# Altium schematic sheet IOs.SchDoc
size A3; SheetNumber: 8; SheetTotal: 11
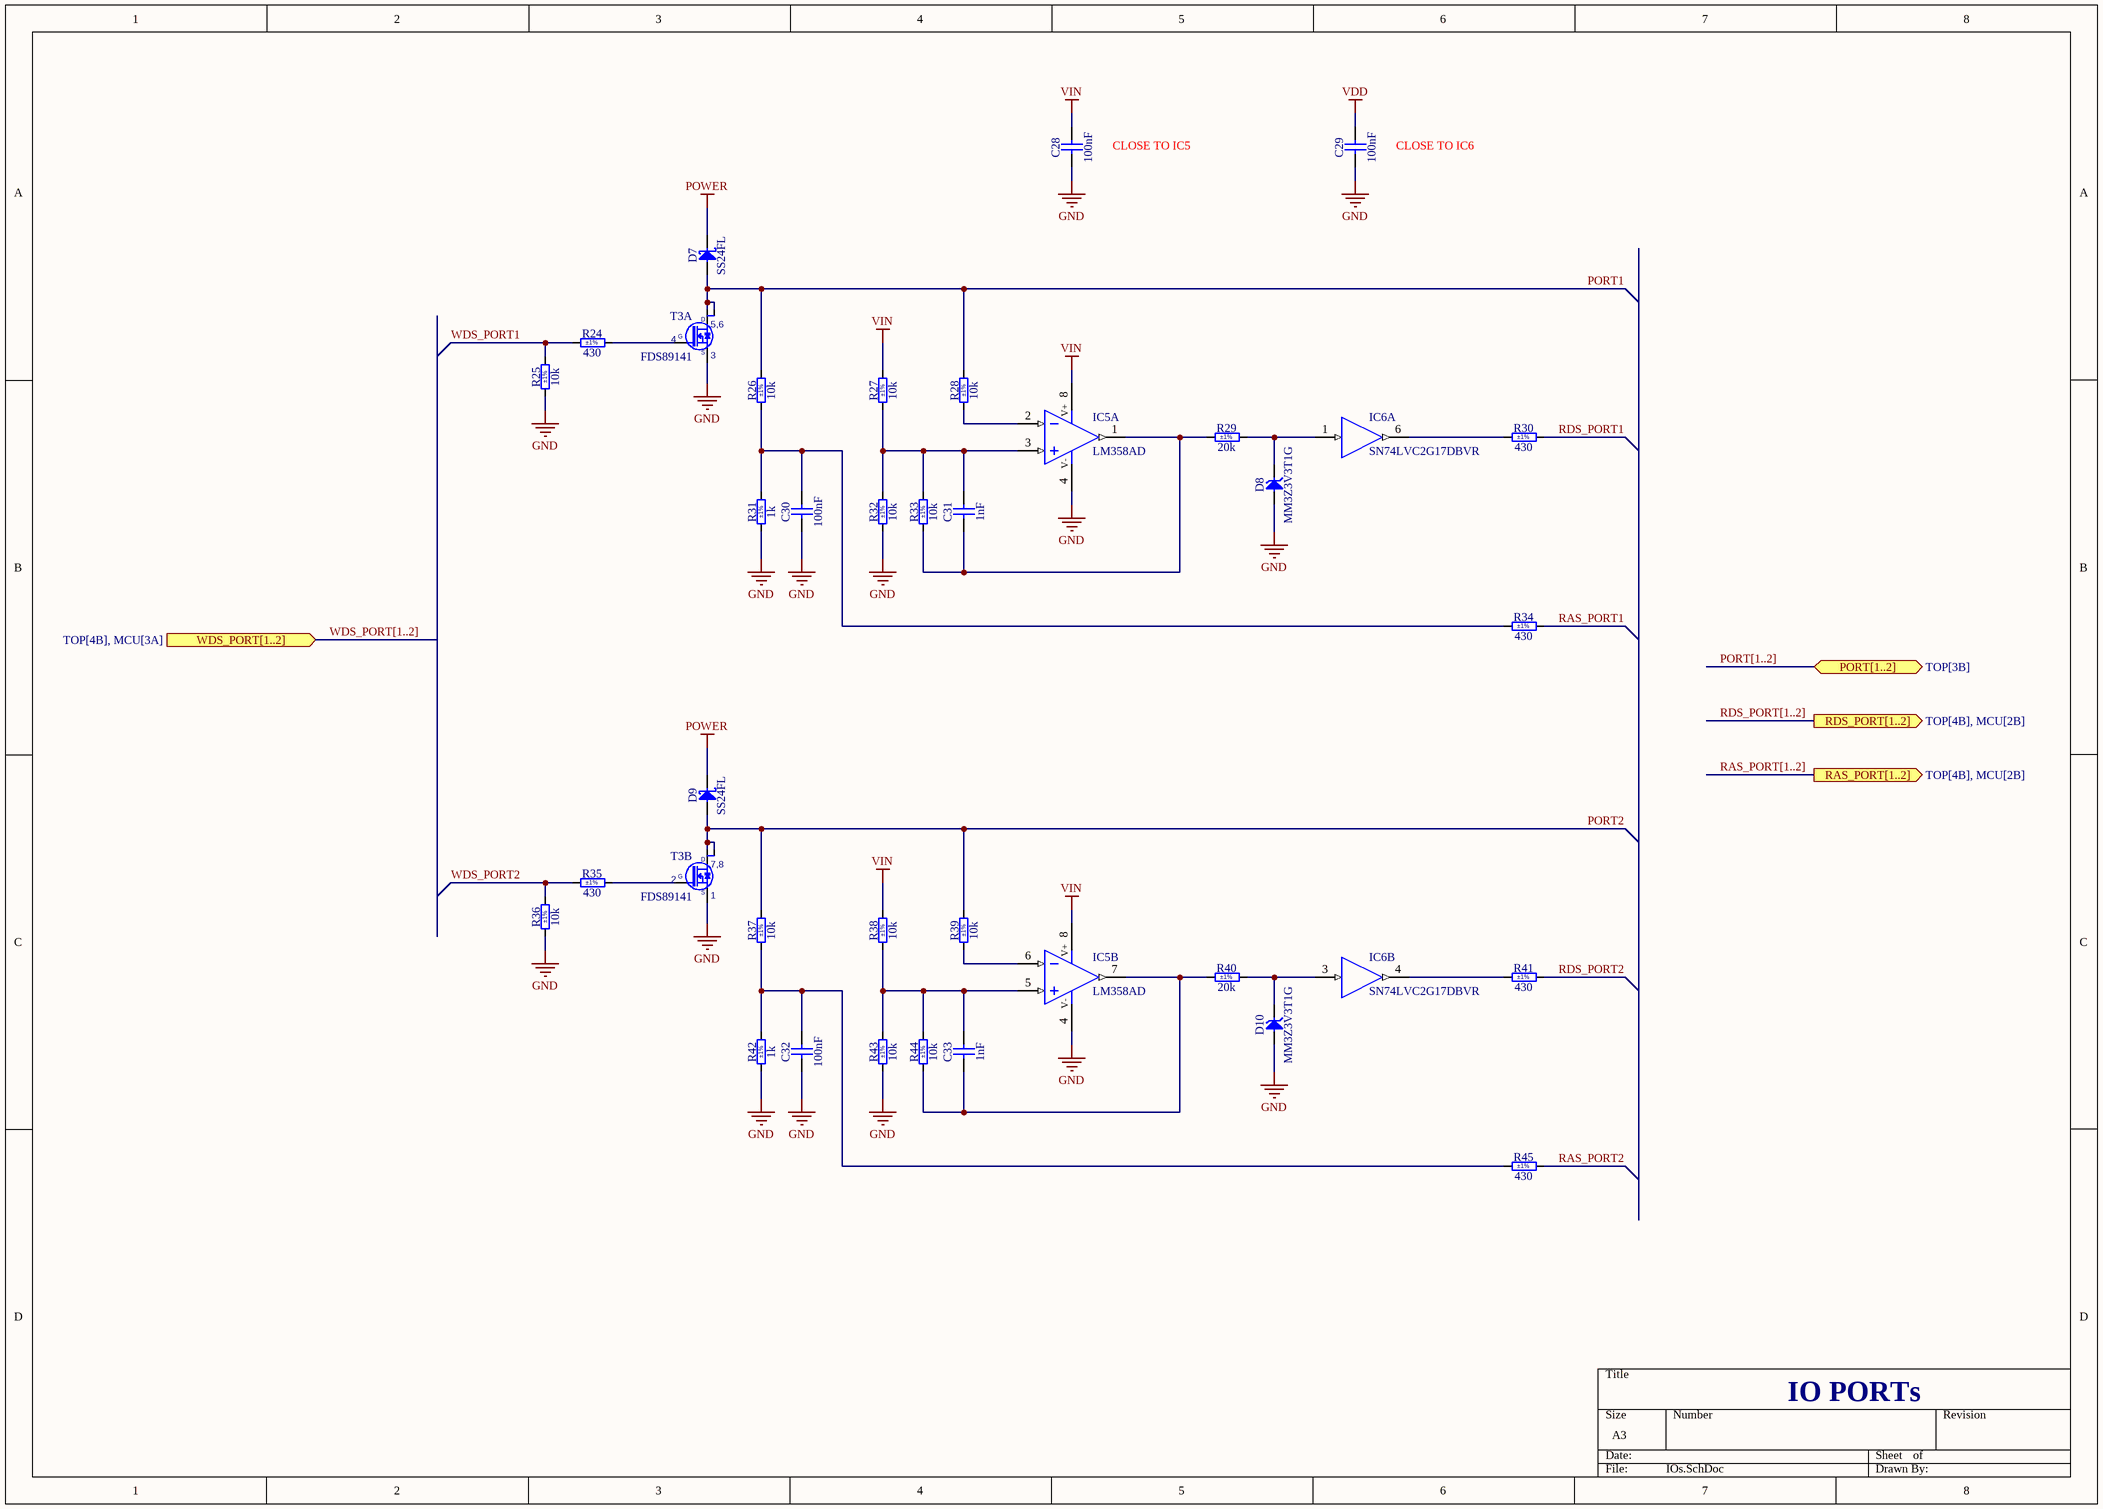
[diagram p0: IOs.SchDoc]

## Parts
C28  100nF  [CAPC1608X90N]
C29  100nF  [CAPC1608X87N]
C30  100nF  [CAPC1608X87N]
C31  1nF  [CAPC1608X87N]
C32  100nF  [CAPC1608X87N]
C33  1nF  [CAPC1608X87N]
D7  SS24FL  [SODFL3617X108N]
D8  MM3Z3V3T1G  [SOD2512X110N]
D9  SS24FL  [SODFL3617X108N]
D10  MM3Z3V3T1G  [SOD2512X110N]
IC5  LM358AD  [SOIC127P600X175-8N]  (parts A,B of 2)
IC6  SN74LVC2G17DBVR  [SOT95P280X145-6N]  (parts A,B of 2)
R24  430  Tolerance: ±1%  [RESC1608X55N]
R25  10k  Tolerance: ±1%  [RESC1608X55N]
R26  10k  Tolerance: ±1%  [RESC3216X65N]
R27  10k  Tolerance: ±1%  [RESC1608X55N]
R28  10k  Tolerance: ±1%  [RESC1608X55N]
R29  20k  Tolerance: ±1%  [RESC1608X55N]
R30  430  Tolerance: ±1%  [RESC1608X55N]
R31  1k  Tolerance: ±1%  [RESC1608X55N]
R32  10k  Tolerance: ±1%  [RESC1608X55N]
R33  10k  Tolerance: ±1%  [RESC1608X55N]
R34  430  Tolerance: ±1%  [RESC1608X55N]
R35  430  Tolerance: ±1%  [RESC1608X55N]
R36  10k  Tolerance: ±1%  [RESC1608X55N]
R37  10k  Tolerance: ±1%  [RESC3216X65N]
R38  10k  Tolerance: ±1%  [RESC1608X55N]
R39  10k  Tolerance: ±1%  [RESC1608X55N]
R40  20k  Tolerance: ±1%  [RESC1608X55N]
R41  430  Tolerance: ±1%  [RESC1608X55N]
R42  1k  Tolerance: ±1%  [RESC1608X55N]
R43  10k  Tolerance: ±1%  [RESC1608X55N]
R44  10k  Tolerance: ±1%  [RESC1608X55N]
R45  430  Tolerance: ±1%  [RESC1608X55N]
T3  FDS89141  [SOIC127P600X175-8N]  (parts A,B of 2)

## Ports
PORT[1..2] (bidir, see TOP[3B]), RAS_PORT[1..2] (out, see TOP[4B], MCU[2B]), RDS_PORT[1..2] (out, see TOP[4B], MCU[2B]), WDS_PORT[1..2] (in, see TOP[4B], MCU[3A])

## Nets
GND: C28.1 C29.1 C30.1 C32.1 D8.2(A) D10.2(A) IC5.4(V-) IC6.2(GND) R25.1 R31.1 R32.1 R36.1 R42.1 R43.1 T3.1(S) T3.3(S)
POWER: D7.1(C) D9.1(C)
VDD: C29.2 IC6.5(VCC)
VIN: C28.2 IC5.8(V+) R27.2 R38.2
PORT1: D7.2(A) R26.2 R28.2 T3.5(D) T3.6(D)
PORT2: D9.2(A) R37.2 R39.2 T3.7(D) T3.8(D)
RAS_PORT1: R34.2
RAS_PORT2: R45.2
RDS_PORT1: R30.2
RDS_PORT2: R41.2
WDS_PORT1: R24.1 R25.2
WDS_PORT2: R35.1 R36.2
NetC30_2: C30.2 R26.1 R31.2 R34.1
NetC31_1: C31.1 IC5.1(OUT) R29.1 R33.1
NetC31_2: C31.2 IC5.3(IN+) R27.1 R32.2 R33.2
NetC32_2: C32.2 R37.1 R42.2 R45.1
NetC33_1: C33.1 IC5.7(OUT) R40.1 R44.1
NetC33_2: C33.2 IC5.5(IN+) R38.1 R43.2 R44.2
NetD8_1: D8.1(C) IC6.1(IN) R29.2
NetD10_1: D10.1(C) IC6.3(IN) R40.2
NetIC5_2: IC5.2(IN-) R28.1
NetIC5_6: IC5.6(IN-) R39.1
NetIC6_4: IC6.4(OUT) R41.1
NetIC6_6: IC6.6(OUT) R30.1
NetR24_2: R24.2 T3.4(G)
NetR35_2: R35.2 T3.2(G)

## Buses and harness runs
bus PORT[1..2] = port PORT[1..2]
bus RAS_PORT[1..2] = port RAS_PORT[1..2]
bus RDS_PORT[1..2] = port RDS_PORT[1..2]
bus WDS_PORT[1..2] = port WDS_PORT[1..2]

## Notes on the sheet
- (near C28) CLOSE TO IC5
- (near C29) CLOSE TO IC6
- IO PORTs
- (in symbol FDS89141, part A) 5,6
- (in symbol FDS89141, part B) 7,8

## Library data of the parts
C28 = CC0603_100NF_100V_10%_X7R: Non-polarised capacitor; Part Description: SMD Multilayer Chip Ceramic Capacitor; Manufacturer: GENERIC; Manufacturer1 Part Number: GRM188R72A104KA35D; Voltage: 100V; TC: X7R; Tolerance: ±10%; Part Number: CC0603_100NF_100V_10%_X7R; Component Kind: Standard; Component Type: Standard; Pin Count: 2; Value: 100nF; Status: None; Manufacturer Part Number: CC0603_100NF_100V_10%_X7R; Case: 0603; Mounted: Yes; Socket: No; SMD: Yes; Sense: No; Manufacturer1 Example: MURATA; Manufacturer1 ComponentHeight: 0.9mm; HelpURL: \\cern.ch\dfs\Applications\Altium\Datasheets\CC0603_MURATA_GRM188R72A104KA35D.pdf; Author: CERN DEM JLC; CreateDate: 11.12.2013; LatestRevisionDate: 11.12.2013
C29 C30 C32 = CC0603_100NF_50V_10%_X7R: Non-polarised capacitor; Part Description: SMD Multilayer Chip Ceramic Capacitor; Manufacturer: GENERIC; Manufacturer1 Part Number: 223858615649; Voltage: 50V; TC: X7R; Tolerance: ±10%; Part Number: CC0603_100NF_50V_10%_X7R; Component Kind: Standard; Component Type: Standard; Pin Count: 2; Value: 100nF; Status: Preferred; Manufacturer Part Number: CC0603_100NF_50V_10%_X7R; Case: 0603; Mounted: Yes; Socket: No; SMD: Yes; Sense: No; Manufacturer1 Example: PHYCOMP; Manufacturer1 ComponentHeight: 0.87mm; HelpURL: \\cern.ch\dfs\Applications\Altium\Datasheets\CC0603_X7R_PHYCOMP.pdf; Author: CERN DEM JLC; CreateDate: 03.12.2007; LatestRevisionDate: 03.12.2007
C31 C33 = CC0603_1NF_50V_10%_X7R: Non-polarised capacitor; Part Description: SMD Multilayer Chip Ceramic Capacitor; Manufacturer: GENERIC; Manufacturer1 Part Number: 223858615623; Voltage: 50V; TC: X7R; Tolerance: ±10%; Part Number: CC0603_1NF_50V_10%_X7R; Component Kind: Standard; Component Type: Standard; Pin Count: 2; Value: 1nF; Status: Preferred; Manufacturer Part Number: CC0603_1NF_50V_10%_X7R; Case: 0603; Mounted: Yes; Socket: No; SMD: Yes; Sense: No; Manufacturer1 Example: PHYCOMP; Manufacturer1 ComponentHeight: 0.87mm; HelpURL: \\cern.ch\dfs\Applications\Altium\Datasheets\CC0603_X7R_PHYCOMP.pdf; Author: CERN DEM JLC; CreateDate: 03.12.2007; LatestRevisionDate: 03.12.2007
D7 D9 = SS24FL: Schottky Diode; Part Description: Surface Mount Schottky Barrier Rectifier; Manufacturer: ON SEMICONDUCTOR; Voltage: 40V; Power: 2A; PressFit: No; Bonding: No; Part Number: SS24FL; Component Kind: Standard; Component Type: Standard; Device: SS24FL; PackageDescription: SODFL Diode (SOD123FL); 2.75mm W X 1.72mm L X 1.08mm H body, IPC Medium Density; Manufacturer Part Number: SS24FL; Pin Count: 2; Case: SOD-123FL; Mounted: Yes; Socket: No; SMD: Yes; Sense: No; ComponentHeight: 1.08mm; HelpURL: \\cern.ch\dfs\Applications\Altium\Datasheets\SS24FL.pdf; Author: CERN DEM BC; CreateDate: 06.10.2020; LatestRevisionDate: 06.10.2020
D8 D10 = MM3Z3V3T1G: Zener Diode; Part Description: Zener Voltage Regulator; Manufacturer: ON SEMICONDUCTOR; Voltage: 3.3V; Power: 200mW; PressFit: No; Bonding: No; Part Number: MM3Z3V3T1G; Component Kind: Standard; Component Type: Standard; Device: MM3Z3V3T1G; PackageDescription: Small Outline Diode (SOD-323), 1.70mm W X 1.25mm L X 1.10mm H body, IPC Medium Density; Manufacturer Part Number: MM3Z3V3T1G; Pin Count: 2; Case: SOD-323; Mounted: Yes; Socket: No; SMD: Yes; Sense: No; ComponentHeight: 1.1mm; HelpURL: \\cern.ch\dfs\Applications\Altium\Datasheets\MM3Z3V3T1G.pdf; Author: CERN DEM JLC; CreateDate: 13.11.2013; LatestRevisionDate: 13.11.2013
IC5 = LM358AD: Dual Operational Amplifier; Part Description: Dual Operational Amplifier, Vos=3mV, Iq/CH=350uA, 0°C to 70°C; Manufacturer: TEXAS INSTRUMENTS; PressFit: No; Bonding: No; Part Number: LM358AD; Component Kind: Standard; Component Type: Standard; Device: LM358AD; PackageDescription: SOIC 8, Pitch 1.27mm - Body 4x5mm, IPC Medium Density; Manufacturer Part Number: LM358AD; Pin Count: 8; Case: SOIC8; Mounted: Yes; Socket: No; SMD: Yes; Sense: No; ComponentHeight: 1.75mm; Author: CERN DEM JLC; HelpURL: \\cern.ch\dfs\Applications\Altium\Datasheets\LM358A.pdf; CreateDate: 02.12.2008; LatestRevisionDate: 06.09.2021
IC6 = SN74LVC2G17DBVR: Dual Schmitt-Trigger Buffer; Manufacturer: TEXAS INSTRUMENTS; PressFit: No; Bonding: No; Part Number: SN74LVC2G17DBVR; Component Kind: Standard; Component Type: Standard; Device: SN74LVC2G17DBVR; PackageDescription: SOT, 0.95mm Pitch; 6 Pin, 1.60mm W X 3.00mm L X 1.45mm H body, IPC Medium Density; Part Description: Dual Schmitt-Trigger Buffer; Manufacturer Part Number: SN74LVC2G17DBV; Pin Count: 6; Case: SOT23-6; Mounted: Yes; Socket: No; SMD: Yes; Sense: No; ComponentHeight: 1.45mm; Author: CERN DEM JLC; HelpURL: \\cern.ch\dfs\Applications\Altium\Datasheets\SN74LVC2G17DBVR.pdf; CreateDate: 25.11.2014; LatestRevisionDate: 25.11.2014
R24 R30 R34 R35 R41 R45 = R0603_430R_1%_0.1W_100PPM: Resistor - 1%; Part Description: General Purpose Thick Film Chip Resistor; Manufacturer: GENERIC; Manufacturer1 Part Number: NRC06F4300TRF; Power: 0.1W; TC: ±100ppm/°C; PressFit: No; Part Number: R0603_430R_1%_0.1W_100PPM; Component Kind: Standard; Component Type: Standard; Pin Count: 2; Value: 430; Status: Preferred; Manufacturer Part Number: R0603_430R_1%_0.1W_100PPM; Case: 0603; Mounted: Yes; Sense: No; Socket: No; SMD: Yes; Manufacturer1 Example: NIC COMPONENT; Manufacturer1 ComponentHeight: 0.55mm; HelpURL: \\cern.ch\dfs\Applications\Altium\Datasheets\R0603_NIC_NRC.pdf; Author: CERN DEM JLC; CreateDate: 03.12.2007; LatestRevisionDate: 13.03.2008
R25 R27 R28 R32 R33 R36 R38 R39 R43 R44 = R0603_10K_1%_0.1W_100PPM: Resistor - 1%; Part Description: General Purpose Thick Film Chip Resistor; Manufacturer: GENERIC; Manufacturer1 Part Number: NRC06F1002TRF; Power: 0.1W; TC: ±100ppm/°C; PressFit: No; Part Number: R0603_10K_1%_0.1W_100PPM; Component Kind: Standard; Component Type: Standard; Pin Count: 2; Value: 10k; Status: Preferred; Manufacturer Part Number: R0603_10K_1%_0.1W_100PPM; Case: 0603; Mounted: Yes; Sense: No; Socket: No; SMD: Yes; Manufacturer1 Example: NIC COMPONENT; Manufacturer1 ComponentHeight: 0.55mm; HelpURL: \\cern.ch\dfs\Applications\Altium\Datasheets\R0603_NIC_NRC.pdf; Author: CERN DEM JLC; CreateDate: 03.12.2007; LatestRevisionDate: 13.03.2008
R26 R37 = R1206_10K_1%_0.25W_100PPM: Resistor - 1%; Part Description: General Purpose Thick Film Chip Resistor; Manufacturer: GENERIC; Manufacturer1 Part Number: NRC12F1002TRF; Power: 0.25W; TC: ±100ppm/°C; PressFit: No; Part Number: R1206_10K_1%_0.25W_100PPM; Component Kind: Standard; Component Type: Standard; Pin Count: 2; Value: 10k; Status: Preferred; Manufacturer Part Number: R1206_10K_1%_0.25W_100PPM; Case: 1206; Mounted: Yes; Sense: No; Socket: No; SMD: Yes; Manufacturer1 Example: NIC COMPONENT; Manufacturer1 ComponentHeight: 0.65mm; HelpURL: \\cern.ch\dfs\Applications\Altium\Datasheets\R1206_NIC_NRC.pdf; Author: CERN DEM JLC; CreateDate: 03.12.2007; LatestRevisionDate: 13.03.2008
R29 R40 = R0603_20K_1%_0.1W_100PPM: Resistor - 1%; Part Description: General Purpose Thick Film Chip Resistor; Manufacturer: GENERIC; Manufacturer1 Part Number: NRC06F2002TRF; Power: 0.1W; TC: ±100ppm/°C; PressFit: No; Part Number: R0603_20K_1%_0.1W_100PPM; Component Kind: Standard; Component Type: Standard; Pin Count: 2; Value: 20k; Status: Preferred; Manufacturer Part Number: R0603_20K_1%_0.1W_100PPM; Case: 0603; Mounted: Yes; Sense: No; Socket: No; SMD: Yes; Manufacturer1 Example: NIC COMPONENT; Manufacturer1 ComponentHeight: 0.55mm; HelpURL: \\cern.ch\dfs\Applications\Altium\Datasheets\R0603_NIC_NRC.pdf; Author: CERN DEM JLC; CreateDate: 03.12.2007; LatestRevisionDate: 13.03.2008
R31 R42 = R0603_1K_1%_0.1W_100PPM: Resistor - 1%; Part Description: General Purpose Thick Film Chip Resistor; Manufacturer: GENERIC; Manufacturer1 Part Number: NRC06F1001TRF; Power: 0.1W; TC: ±100ppm/°C; PressFit: No; Part Number: R0603_1K_1%_0.1W_100PPM; Component Kind: Standard; Component Type: Standard; Pin Count: 2; Value: 1k; Status: Preferred; Manufacturer Part Number: R0603_1K_1%_0.1W_100PPM; Case: 0603; Mounted: Yes; Sense: No; Socket: No; SMD: Yes; Manufacturer1 Example: NIC COMPONENT; Manufacturer1 ComponentHeight: 0.55mm; HelpURL: \\cern.ch\dfs\Applications\Altium\Datasheets\R0603_NIC_NRC.pdf; Author: CERN DEM JLC; CreateDate: 03.12.2007; LatestRevisionDate: 13.03.2008
T3 = FDS89141: 100V Dual N-Channel PowerTrench® MOSFET; Part Description: 100V, Dual N-Channel PowerTrench® MOSFET; Manufacturer: FAIRCHILD SEMICONDUCTOR; PressFit: No; Bonding: No; Part Number: FDS89141; Component Kind: Standard; Component Type: Standard; Device: FDS89141; PackageDescription: SOIC 8, Pitch 1.27mm - Body 4x5mm, IPC Medium Density; Manufacturer Part Number: FDS89141; Pin Count: 8; Case: SOIC8; Mounted: Yes; Socket: No; SMD: Yes; Sense: No; ComponentHeight: 1.75mm; HelpURL: \\cern.ch\dfs\Applications\Altium\Datasheets\FDS89141.pdf; Author: CERN DEM JLC; CreateDate: 15.11.2016; LatestRevisionDate: 15.11.2016